# Altium schematic sheet Sample_and_hold.SchDoc
size A4
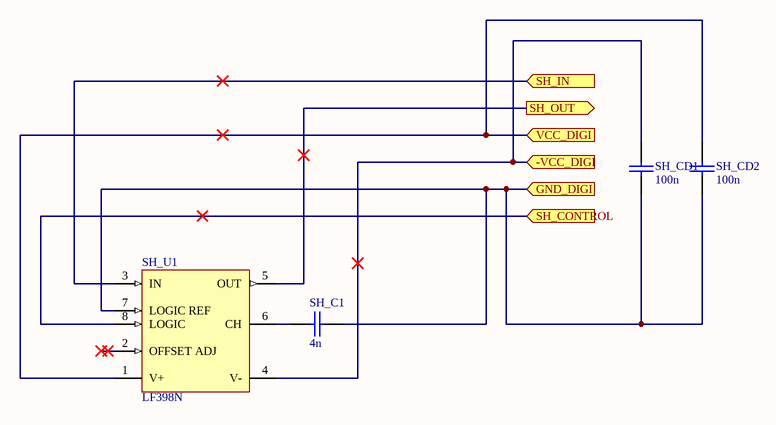
[diagram p0: Sample_and_hold.SchDoc]

## Parts
SH_C1  4n  [CAP200]
SH_CD1  100n  [CAP200]
SH_CD2  100n  [CAP200]
SH_U1  LF398N  [N08E]

## Ports
-VCC_DIGI (in), GND_DIGI (in), SH_CONTROL (in), SH_IN (in), SH_OUT (out), VCC_DIGI (in)

## Nets
-VCC_DIGI: SH_CD1.1 SH_U1.4(V-) ; port -VCC_DIGI
GND_DIGI: SH_C1.2 SH_CD1.2 SH_CD2.2 SH_U1.7(LOGIC_REF) ; port GND_DIGI
SH_CONTROL: SH_U1.8(LOGIC) ; port SH_CONTROL
SH_IN: SH_U1.3(IN) ; port SH_IN
SH_OUT: SH_U1.5(OUT) ; port SH_OUT
VCC_DIGI: SH_CD2.1 SH_U1.1(V+) ; port VCC_DIGI
NetSH_C1_1: SH_C1.1 SH_U1.6(CH)

Not connected (* = marked no-connect by the designer): SH_U1 2(OFFSET_ADJ)*

## Library data of the parts
SH_C1 SH_CD1 SH_CD2 = CAP
SH_U1 = LF398N: Monolithic Sample and Hold Circuits, 8-pin MDIP; Manufacturer: National Semiconductor; PackageTopMarking: NSUZXYTTE#*LF*398N; PowerWise: N; CompType: Analog IC; PinCount: 8; DatasheetVersion: Jul-2000; Code_JEDEC: MS-001-BA; PackageVersion: revG, May-2006; PackageReference: N08E; PackageDescription: MDIP, .365 x .250 x .130in, 8 Lead, .100in Pitch; RoHS: N; PartNumber: LF398N